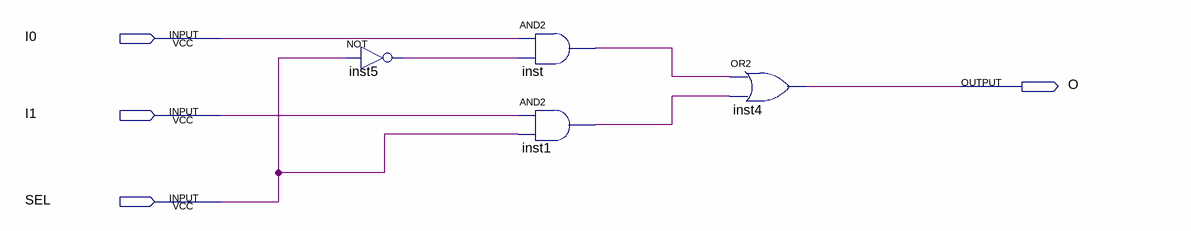
[diagram p0: schematic sheet]
// Quartus schematic mux2_1.bdf as structural Verilog: 4 symbols, 4 pins
module mux2_1 (
  input  I0,
  input  I1,
  input  SEL,
  output O
);

  wire inst1_out, inst5_out, inst_out;

  not inst5 (inst5_out, SEL);
  and inst (inst_out, I0, inst5_out);
  and inst1 (inst1_out, I1, SEL);
  or inst4 (O, inst_out, inst1_out);
endmodule
